# EAGLE board printer_v1 (EAGLE 9.6.2)
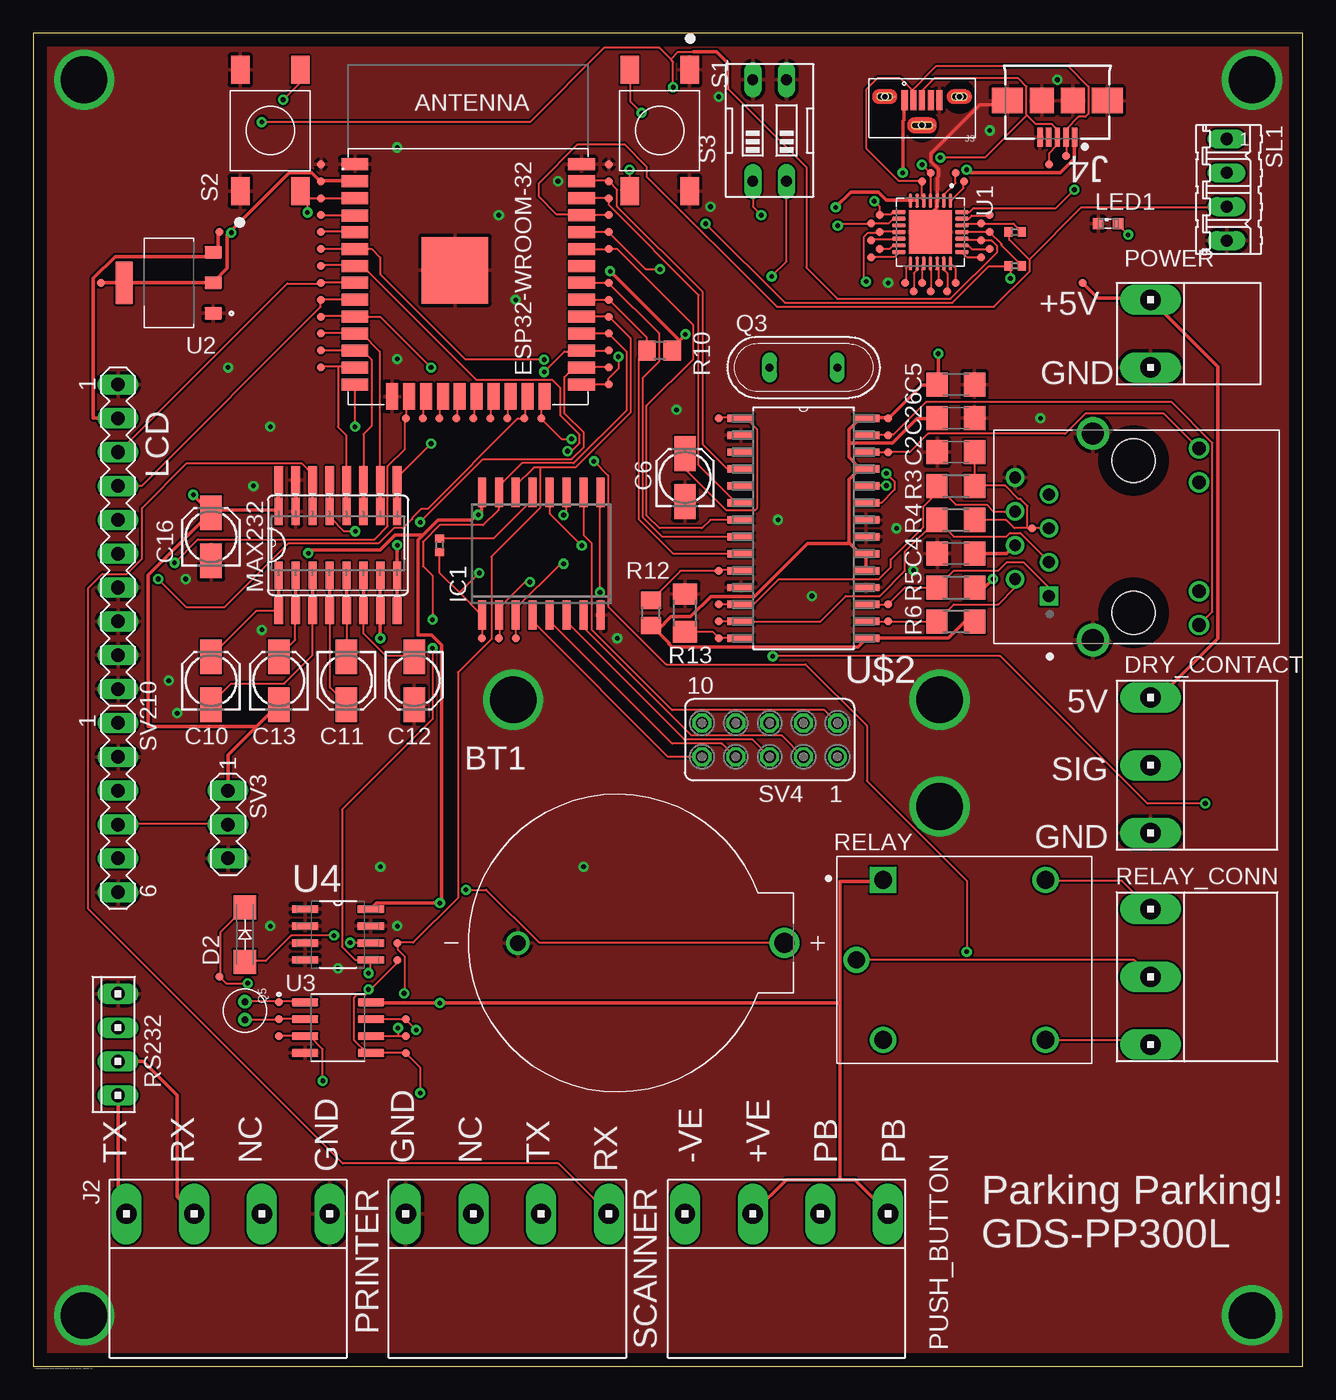
[diagram p2: board, top side]
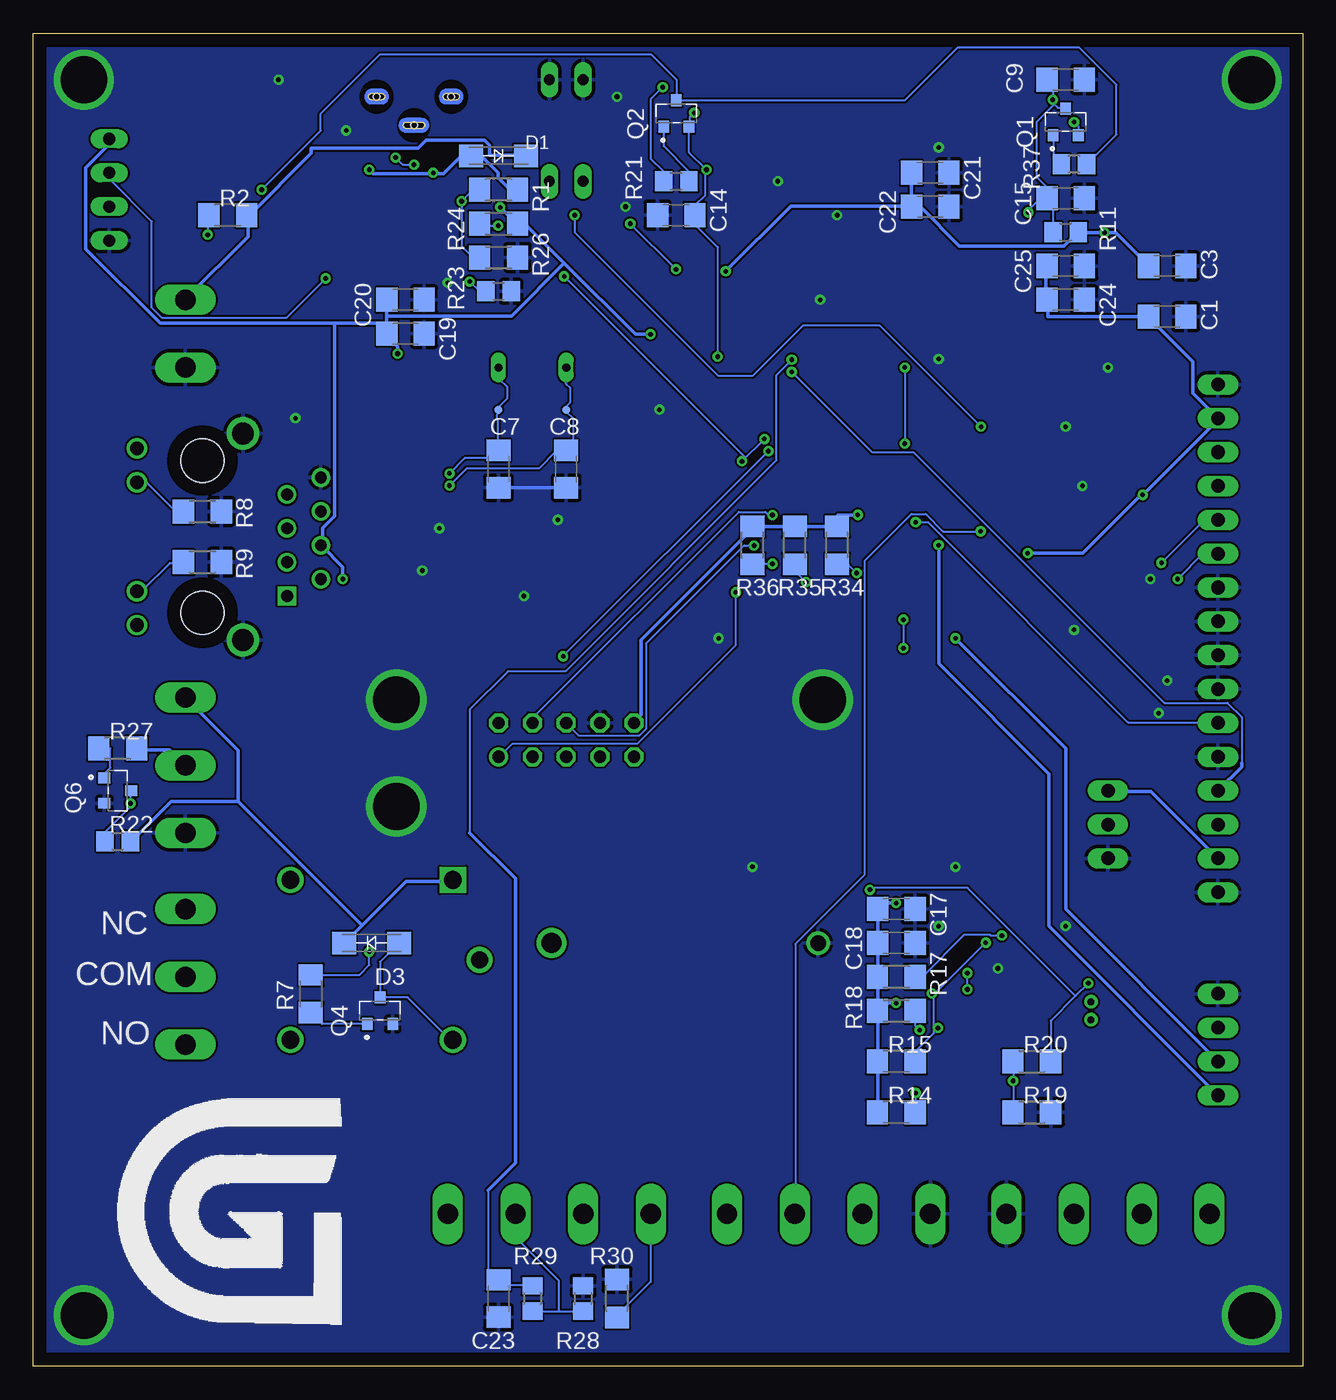
[diagram p3: board, bottom side, seen from below]

Size 95.23 x 100 mm. Coordinates in mm from the lower left corner, seen from the top.
Outline: 0,0 95.23,0 95.23,100 0,100 0,0
Copper layers (1*16): Top 0.035mm / dielectric 1.5mm / Bottom 0.035mm
Design rules "default": minimum track width 6mil, minimum drill 0.35mm, track to track 6mil, track to pad 6mil, pad to pad 6mil, via to via 6mil, smd to smd 6mil, copper to edge 40mil, drill to drill 6mil, minimum pad ring 10mil, minimum via ring 8mil, stop-mask expansion 4mil, vias tented up to drill 0mil, thermal gap 10mil
Net classes: 1 POWER: width 0.254 mm

## Footprints (pad centres in the part's own frame; a part is rotated, then mirrored left to right if it is on the bottom)
BAT_BS-7 = drill 1.5: + 10,0 | drill 1.17: - -10,0
C1206 = smd 1.6 x 1.8: 1 -1.4,0; 2 1.4,0
153CLV-0405 = smd 2.6 x 1.6: + 1.8,0; - -1.8,0
SMA-DO214AC = smd 1.8 x 1.7: A -2.05,0; K 2.05,0
10X05MTA_MYV = drill 1.524 long: 1 5.08,0; 3 0,0; 5 -5.08,0
SO16W = smd 0.6 x 2.2: 1 -4.445,-4.6; 2 -3.175,-4.6; 3 -1.905,-4.6; 4 -0.635,-4.6; 5 0.635,-4.6; 6 1.905,-4.6; 7 3.175,-4.6; 8 4.445,-4.6; 9 4.445,4.6; 10 3.175,4.6; 11 1.905,4.6; 12 0.635,4.6; 13 -0.635,4.6; 14 -1.905,4.6; 15 -3.175,4.6; 16 -4.445,4.6
HANRUN_HR911105A = drill 0.89 square: 1 4.45,-6.35 | drill 0.89: 2 3.18,-8.89; 3 1.91,-6.35; 4 0.64,-8.89; 5 -0.63,-6.35; 6 -1.9,-8.89; 7 -3.17,-6.35; 8 -4.44,-8.89 | drill 1.02: 9 6.625,4.9; 10 4.085,4.9; 11 -4.085,4.9; 12 -6.625,4.9 | drill 1.63: 15 7.745,-3.05; 16 -7.745,-3.05 | hole 3.25: -5.715,0; 5.715,0
10X07MTA_MYV = drill 1.524 long: 1 7.62,0; 3 2.54,0; 5 -2.54,0; 7 -7.62,0
MOLEX_105133-0001 = smd 0.45 x 1.5: 1 -1.3,-0.25; 2 -0.65,-0.25; 3 0,-0.25; 4 0.65,-0.25; 5 1.3,-0.25 | smd 0.1 x 0.1: S1 -2.05,0; S2 3.55,0; S3 0.95,-2.15 | hole 0.5: -2.8,0; 2.8,0; 0,-2.15
GCT_USB3065-XX-00-A_REVE = smd 0.4 x 1.4: 1 -1.3,0.5; 2 -0.65,0.5; 3 0,0.5; 4 0.65,0.5; 5 1.3,0.5 | smd 1.8 x 1.9: 6 1.15,-2.25; 7 -1.15,-2.25 | smd 2.3 x 1.9: 8 3.75,-2.25; 9 -3.75,-2.25
SML0603 = smd 0.8 x 0.8: A 0.75,0; C -0.75,0
SO16L = smd 0.66 x 2.032: 1 -4.445,-4.902; 2 -3.175,-4.902; 3 -1.905,-4.902; 4 -0.635,-4.902; 5 0.635,-4.902; 6 1.905,-4.902; 7 3.175,-4.902; 8 4.445,-4.902; 9 4.445,4.902; 10 3.175,4.902; 11 1.905,4.902; 12 0.635,4.902; 13 -0.635,4.902; 14 -1.905,4.902; 15 -3.175,4.902; 16 -4.445,4.902
10X03MTA_MYV = drill 1.524 long: 1 2.54,0; 3 -2.54,0
TRANS_MMSS8050-H-TP = smd 0.9 x 0.8: 1 -1,0.95; 2 -1,-0.95; 3 1,0
QS = drill 0.61 long: 1 -2.54,0; 2 2.54,0
XTAL_ECS-160-18-9X = drill 0.52 pad 0.92: 1 -0.677,0; 2 0.677,0
R1206 = smd 1.6 x 1.803: 1 -1.422,0; 2 1.422,0
R0805 = smd 1.3 x 1.5: 1 -0.95,0; 2 0.95,0
R0402 = smd 0.6 x 0.7: 1 -0.5,0; 2 0.5,0
RELAY_SRD-05VDC-SL-C = drill 1.32 square: A1 -6.1,6 | drill 1.32: A2 -6.1,-6; NC 6.1,6; NO 6.1,-6 | drill 1.29: COM -8.1,0
10X04MTA = drill 1.016 long: 1 3.81,0; 2 1.27,0; 3 -1.27,0; 4 -3.81,0
SW_5-1437565-0 = smd 2.1 x 1.4: 1 -4.55,2.25; 2 4.55,2.25; 3 -4.55,-2.25; 4 4.55,-2.25
EDG-02 = drill 0.813 long: 1 -1.27,-3.81; 2 1.27,-3.81; 3 1.27,3.81; 4 -1.27,3.81
04P = drill 0.914 long: 1 -3.81,0; 2 -1.27,0; 3 1.27,0; 4 3.81,0
MA10-1 = drill 1.016 long: 1 -11.43,0; 2 -8.89,0; 3 -6.35,0; 4 -3.81,0; 5 -1.27,0; 6 1.27,0; 7 3.81,0; 8 6.35,0; 9 8.89,0; 10 11.43,0
MA06-1 = drill 1.016 long: 1 -6.35,0; 2 -3.81,0; 3 -1.27,0; 4 1.27,0; 5 3.81,0; 6 6.35,0
MA03-1 = drill 1.016 long: 1 -2.54,0; 2 0,0; 3 2.54,0
FE05-2 = drill 0.914: 1 -5.08,1.27 | drill 0.914 octagon: 2 -5.08,-1.27; 3 -2.54,1.27; 4 -2.54,-1.27; 5 0,1.27; 6 0,-1.27; 7 2.54,1.27; 8 2.54,-1.27; 9 5.08,1.27; 10 5.08,-1.27
TP06R = smd 0.6 x 0.6: TP 0,0
QFN50P500X500X80-29N = smd 1.01 x 0.27: 1 -2.36,1.5; 2 -2.36,1; 3 -2.36,0.5; 4 -2.36,0; 5 -2.36,-0.5; 6 -2.36,-1; 7 -2.36,-1.5; 15 2.36,-1.5; 16 2.36,-1; 17 2.36,-0.5; 18 2.36,0; 19 2.36,0.5; 20 2.36,1; 21 2.36,1.5 | smd 0.27 x 1.01: 8 -1.5,-2.36; 9 -1,-2.36; 10 -0.5,-2.36; 11 0,-2.36; 12 0.5,-2.36; 13 1,-2.36; 14 1.5,-2.36; 22 1.5,2.36; 23 1,2.36; 24 0.5,2.36; 25 0,2.36; 26 -0.5,2.36; 27 -1,2.36; 28 -1.5,2.36 | smd 3.25 x 3.25: 29 0,0
SOT229P700X180-4N = smd 1.31 x 0.93: 1 -3.345,2.29; 2 -3.345,0; 3 -3.345,-2.29 | smd 1.31 x 3.24: 4 3.345,0
SOIC127P600X175-8N = smd 1.97 x 0.59: 1 -2.475,1.905; 2 -2.475,0.635; 3 -2.475,-0.635; 4 -2.475,-1.905; 5 2.475,-1.905; 6 2.475,-0.635; 7 2.475,0.635; 8 2.475,1.905
SOIC127P600X175-8N' = smd 1.981 x 0.559: 1 -2.464,1.905; 2 -2.464,0.635; 3 -2.464,-0.635; 4 -2.464,-1.905; 5 2.464,-1.905; 6 2.464,-0.635; 7 2.464,0.635; 8 2.464,1.905
SOIC127P600X175-16N = smd 2.057 x 0.61: 1 -4.801,8.89; 2 -4.801,7.62; 3 -4.801,6.35; 4 -4.801,5.08; 5 -4.801,3.81; 6 -4.801,2.54; 7 -4.801,1.27; 8 -4.801,0; 9 0,0; 10 0,1.27; 11 0,2.54; 12 0,3.81; 13 0,5.08; 14 0,6.35; 15 0,7.62; 16 0,8.89
SOIC127P1034X264-28N = smd 1.981 x 0.559: 1 -4.699,8.255; 2 -4.699,6.985; 3 -4.699,5.715; 4 -4.699,4.445; 5 -4.699,3.175; 6 -4.699,1.905; 7 -4.699,0.635; 8 -4.699,-0.635; 9 -4.699,-1.905; 10 -4.699,-3.175; 11 -4.699,-4.445; 12 -4.699,-5.715; 13 -4.699,-6.985; 14 -4.699,-8.255; 15 4.699,-8.255; 16 4.699,-6.985; 17 4.699,-5.715; 18 4.699,-4.445; 19 4.699,-3.175; 20 4.699,-1.905; 21 4.699,-0.635; 22 4.699,0.635; 23 4.699,1.905; 24 4.699,3.175; 25 4.699,4.445; 26 4.699,5.715; 27 4.699,6.985; 28 4.699,8.255
ESP32-WROOM-32 = smd 2 x 0.9: 1 0,0; 2 0,-1.27; 3 -0.01,-2.54; 4 0,-3.84; 5 0,-5.08; 6 0,-6.35; 7 0,-7.62; 8 0,-8.89; 9 0,-10.16; 10 0,-11.43; 11 0,-12.7; 12 0,-13.97; 13 0,-15.24; 14 0,-16.51; 25 16.999,-16.511; 26 16.999,-15.239; 27 17.001,-13.971; 28 16.999,-12.702; 29 16.997,-11.432; 30 16.999,-10.161; 31 17.002,-8.891; 32 17,-7.622; 33 17,-6.35; 34 17,-5.08; 35 17,-3.81; 36 17,-2.54; 37 17,-1.27; 38 17,0 | smd 0.9 x 2: 15 2.785,-17.41; 16 4.055,-17.41; 17 5.325,-17.41; 18 6.595,-17.41; 19 7.865,-17.41; 20 9.135,-17.41; 21 10.405,-17.41; 22 11.675,-17.41; 23 12.945,-17.41; 24 14.215,-17.41 | smd 5 x 5: 39 7.502,-7.946

## Placement (x,y rotation side)
BT1  BS-7  [BAT_BS-7]  46.35,31.75 0 top
C1  22uf  [C1206]  10.16,78.74 0 bottom
C2  0.1uf  [C1206]  69.22,68.58 0 top
C3  22uf  [C1206]  10.16,82.55 0 bottom
C4  0.1uf  [C1206]  69.22,60.96 0 top
C5  0.1uf  [C1206]  69.22,73.66 0 top
C6  10uf  [153CLV-0405]  48.9,66.67 90 top
C7  10pf  [C1206]  60.33,67.31 270 bottom
C8  10pf  [C1206]  55.24,67.31 270 bottom
C9  0.1uf  [C1206]  17.78,96.52 0 bottom
C10  1uf  [153CLV-0405]  13.34,51.44 90 top
C11  1uf  [153CLV-0405]  23.5,51.44 270 top
C12  1uf  [153CLV-0405]  28.57,51.44 270 top
C13  1uf  [153CLV-0405]  18.41,51.44 90 top
C14  0.1uf  [C1206]  46.99,86.36 180 bottom
C15  0.1uf  [C1206]  17.78,87.63 0 bottom
C16  1uf  [153CLV-0405]  13.34,62.23 90 top
C17  0.1uf  [C1206]  30.48,34.29 0 bottom
C18  0.1uf  [C1206]  30.48,31.75 0 bottom
C19  0.1uf  [C1206]  67.31,77.47 0 bottom
C20  4.7uf  [C1206]  67.31,80.01 0 bottom
C21  22uf  [C1206]  27.94,89.53 0 bottom
C22  0.1uf  [C1206]  27.94,87 0 bottom
C23  1uf  [C1206]  60.33,5.08 90 bottom
C24  0.1uf  [C1206]  17.78,80.01 0 bottom
C25  0.1uf  [C1206]  17.78,82.55 0 bottom
C26  0.1uf  [C1206]  69.22,71.12 0 top
D1  GF1  [SMA-DO214AC]  60.33,90.81 0 bottom
D2  GF1  [SMA-DO214AC]  15.88,32.38 90 top
D3  GF1  [SMA-DO214AC]  69.85,31.75 180 bottom
DRY_CONTACT  [10X05MTA_MYV]  83.82,45.09 270 top
IC1  PCF8574T  [SO16W]  38.1,60.96 0 top
J1  HR911105A  [HANRUN_HR911105A]  82.55,62.23 270 top
J2  [10X07MTA_MYV]  14.61,11.43 180 top
J3  105133-0001  [MOLEX_105133-0001]  66.67,95.25 0 top
J4  USB3065-XX-00-A_REVE  [GCT_USB3065-XX-00-A_REVE]  76.83,92.71 180 top
LED1  [SML0603]  80.64,85.72 0 top
MAX232  MAX232ECWE  [SO16L]  22.86,61.59 0 top
POWER  [10X03MTA_MYV]  83.82,77.47 270 top
PUSH_BUTTON  [10X07MTA_MYV]  56.52,11.43 180 top
Q1  MMSS8050-H-TP  [TRANS_MMSS8050-H-TP]  17.78,93.34 90 bottom
Q2  MMSS8050-H-TP  [TRANS_MMSS8050-H-TP]  46.99,93.98 90 bottom
Q3  [QS]  57.78,74.93 0 top
Q4  MMSS8050-H-TP  [TRANS_MMSS8050-H-TP]  69.22,26.67 90 bottom
Q5  ECS-327-18-9  [XTAL_ECS-160-18-9X]  15.88,26.67 270 top
Q6  MMSS8050-H-TP  [TRANS_MMSS8050-H-TP]  88.9,43.18 0 bottom
R1  22.1k  [R1206]  60.33,88.27 0 bottom
R2  2k  [R1206]  80.64,86.36 0 bottom
R3  50  [R1206]  69.22,66.04 180 top
R4  50  [R1206]  69.22,63.5 180 top
R5  50  [R1206]  69.22,58.42 180 top
R6  50  [R1206]  69.22,55.88 180 top
R7  330  [R1206]  74.42,27.94 90 bottom
R8  220  [R1206]  82.55,64.14 180 bottom
R9  220  [R1206]  82.55,60.33 180 bottom
R10  10k  [R0805]  46.99,76.2 180 top
R11  10k  [R0805]  17.78,85.09 0 bottom
R12  10k  [R0805]  46.35,56.52 90 top
R13  2k  [R1206]  48.9,56.52 270 top
R14  3.3K  [R1206]  30.48,19.05 0 bottom
R15  3.3K  [R1206]  30.48,22.86 0 bottom
R17  200  [R1206]  30.48,29.21 0 bottom
R18  3.3K  [R1206]  30.48,26.67 180 bottom
R19  1.5M  [R1206]  20.32,19.05 180 bottom
R20  510K  [R1206]  20.32,22.86 180 bottom
R21  10k  [R0805]  46.99,88.9 0 bottom
R22  10k  [R0805]  88.9,39.37 0 bottom
R23  10k  [R0805]  60.33,80.64 0 bottom
R24  2k  [R1206]  60.33,85.72 180 bottom
R26  47.5k  [R1206]  60.33,83.19 180 bottom
R27  330  [R1206]  88.9,46.35 0 bottom
R28  10k  [R0805]  53.98,5.08 270 bottom
R29  10k  [R0805]  57.78,5.08 270 bottom
R30  330  [R1206]  51.44,5.08 270 bottom
R34  3.3K  [R1206]  34.92,61.59 270 bottom
R35  3.3K  [R1206]  38.1,61.59 270 bottom
R36  3.3K  [R1206]  41.27,61.59 270 bottom
R37  10k  [R0805]  17.14,90.17 180 bottom
R38  50  [R0402]  73.66,85.09 0 top
R39  50  [R0402]  73.66,82.55 0 top
R40NC  50  [R0402]  30.48,61.59 90 top
RELAY  SRD-05VDC-SL-C  [RELAY_SRD-05VDC-SL-C]  69.85,30.48 0 top
RELAY_CONN  [10X05MTA_MYV]  83.82,29.21 270 top
RS232  [10X04MTA]  6.35,24.13 90 top
S1  5-1437565-0  [SW_5-1437565-0]  46.99,92.71 270 top
S2  5-1437565-0  [SW_5-1437565-0]  17.78,92.71 90 top
S3  [EDG-02]  55.24,92.71 0 top
SCANNER  [10X07MTA_MYV]  35.56,11.43 180 top
SL1  [04P]  89.53,88.27 270 top
SV1  [MA10-1]  6.35,62.23 270 top
SV2  [MA06-1]  6.35,41.91 270 top
SV3  [MA03-1]  14.61,40.64 270 top
SV4  [FE05-2]  55.24,46.99 180 top
TP1  TPTP06R  [TP06R]  21.59,87.63 0 top
TP2  TPTP06R  [TP06R]  21.59,86.36 0 top
TP3  TPTP06R  [TP06R]  21.59,85.09 0 top
TP4  TPTP06R  [TP06R]  21.59,83.82 0 top
TP5  TPTP06R  [TP06R]  21.59,82.55 0 top
TP6  TPTP06R  [TP06R]  21.59,81.28 0 top
TP7  TPTP06R  [TP06R]  21.59,80.01 0 top
TP8  TPTP06R  [TP06R]  21.59,78.74 0 top
TP9  TPTP06R  [TP06R]  21.59,77.47 0 top
TP10  TPTP06R  [TP06R]  21.59,76.2 0 top
TP11  TPTP06R  [TP06R]  21.59,74.93 0 top
TP13  TPTP06R  [TP06R]  21.59,90.17 0 top
TP14  TPTP06R  [TP06R]  27.94,71.12 0 top
TP15  TPTP06R  [TP06R]  29.21,71.12 0 top
TP16  TPTP06R  [TP06R]  30.48,71.12 0 top
TP17  TPTP06R  [TP06R]  31.75,71.12 0 top
TP18  TPTP06R  [TP06R]  33.02,71.12 0 top
TP19  TPTP06R  [TP06R]  34.29,71.12 0 top
TP20  TPTP06R  [TP06R]  35.56,71.12 0 top
TP21  TPTP06R  [TP06R]  36.83,71.12 0 top
TP22  TPTP06R  [TP06R]  38.1,71.12 0 top
TP23  TPTP06R  [TP06R]  43.18,88.9 0 top
TP24  TPTP06R  [TP06R]  43.18,87.63 0 top
TP25  TPTP06R  [TP06R]  43.18,86.36 0 top
TP26  TPTP06R  [TP06R]  43.18,85.09 0 top
TP27  TPTP06R  [TP06R]  43.18,83.82 0 top
TP28  TPTP06R  [TP06R]  43.18,81.28 0 top
TP29  TPTP06R  [TP06R]  43.18,80.01 0 top
TP30  TPTP06R  [TP06R]  27.94,24.77 0 top
TP31  TPTP06R  [TP06R]  27.94,23.5 0 top
TP32  TPTP06R  [TP06R]  43.18,76.2 0 top
TP33  TPTP06R  [TP06R]  43.18,74.93 0 top
TP34  TPTP06R  [TP06R]  43.18,73.66 0 top
TP50  TPTP06R  [TP06R]  51.44,71.12 0 top
TP53  TPTP06R  [TP06R]  51.44,54.61 0 top
TP54  TPTP06R  [TP06R]  60.33,71.75 0 bottom
TP55  TPTP06R  [TP06R]  51.44,59.69 0 top
TP56  TPTP06R  [TP06R]  51.44,57.15 0 top
TP57  TPTP06R  [TP06R]  51.44,55.88 0 top
TP58  TPTP06R  [TP06R]  43.18,90.17 0 top
TP59  TPTP06R  [TP06R]  21.59,88.9 0 top
TP62  TPTP06R  [TP06R]  64.14,55.88 0 top
TP63  TPTP06R  [TP06R]  64.14,57.15 0 top
TP64  TPTP06R  [TP06R]  55.24,71.75 0 bottom
TP65  TPTP06R  [TP06R]  64.14,68.58 0 top
TP66  TPTP06R  [TP06R]  64.14,69.85 0 top
TP68  TPTP06R  [TP06R]  74.93,62.87 0 top
TP71  TPTP06R  [TP06R]  5.08,81.28 0 top
TP78  TPTP06R  [TP06R]  13.97,29.21 0 top
TP79  TPTP06R  [TP06R]  27.3,31.75 0 top
TP80  TPTP06R  [TP06R]  18.41,27.3 0 top
TP81  TPTP06R  [TP06R]  27.3,30.48 0 top
TP82  TPTP06R  [TP06R]  18.41,24.77 0 top
TP83  TPTP06R  [TP06R]  13.97,85.09 90 top
TP84  TPTP06R  [TP06R]  27.94,26.04 0 top
TP85  TPTP06R  [TP06R]  18.41,26.04 0 top
TP86  TPTP06R  [TP06R]  43.18,78.74 0 top
TP87  TPTP06R  [TP06R]  78.74,81.28 0 top
TP88  TPTP06R  [TP06R]  43.18,77.47 0 top
TP89  TPTP06R  [TP06R]  33.66,54.61 0 top
TP90  TPTP06R  [TP06R]  34.92,54.61 0 top
TP91  TPTP06R  [TP06R]  36.2,54.61 0 top
TP99  TPTP06R  [TP06R]  66.67,88.9 0 top
TP100  TPTP06R  [TP06R]  67.31,89.53 0 top
TP102  TPTP06R  [TP06R]  64.14,71.12 0 top
TP103  TPTP06R  [TP06R]  71.75,85.09 0 top
TP104  TPTP06R  [TP06R]  71.12,85.72 0 top
TP105  TPTP06R  [TP06R]  71.12,84.45 0 top
TP106  TPTP06R  [TP06R]  71.75,83.82 0 top
TP107  TPTP06R  [TP06R]  71.75,86.36 0 top
TP109  TPTP06R  [TP06R]  69.85,88.9 0 top
TP110  TPTP06R  [TP06R]  76.2,90.17 0 top
TP111  TPTP06R  [TP06R]  77.47,90.81 0 top
TP112  TPTP06R  [TP06R]  62.87,85.72 0 top
TP113  TPTP06R  [TP06R]  69.22,89.53 0 top
TP114  TPTP06R  [TP06R]  63.5,86.36 0 top
TP115  TPTP06R  [TP06R]  67.94,81.28 0 top
TP116  TPTP06R  [TP06R]  67.31,80.64 0 top
TP117  TPTP06R  [TP06R]  66.67,81.28 0 top
TP118  TPTP06R  [TP06R]  66.04,80.64 0 top
TP119  TPTP06R  [TP06R]  71.12,83.19 0 top
TP120  TPTP06R  [TP06R]  69.22,81.28 0 top
TP121  TPTP06R  [TP06R]  68.58,80.64 0 top
TP122  TPTP06R  [TP06R]  62.87,84.45 0 top
TP123  TPTP06R  [TP06R]  63.5,85.09 0 top
TP124  TPTP06R  [TP06R]  62.87,83.19 0 top
TP125  TPTP06R  [TP06R]  65.41,81.28 0 top
TP126  TPTP06R  [TP06R]  63.5,83.82 0 top
U1  CP2102N-A01-GQFN28  [QFN50P500X500X80-29N]  67.31,85.09 270 top
U2  AMS1117  [SOT229P700X180-4N]  10.16,81.28 180 top
U3  DS1307Z+  [SOIC127P600X175-8N]  22.86,25.4 0 top
U4  CAT24C32WI-GT3  [SOIC127P600X175-8N']  22.86,32.38 0 top
U5  MAX232D  [SOIC127P600X175-16N]  27.3,64.14 90 top
U$2  ENC28J60/SO  [SOIC127P1034X264-28N]  57.78,62.87 0 top
U$3  ESP32-WROOM-32  [ESP32-WROOM-32]  24.13,90.17 0 top

## Tracks (layer width: path | path; a pad name or v marks a point on that pad's centre or on a via)
3V3  (via drill 0.35)
  Top 0.254: U$2.19 U$2.20 62.41,61.04 61.95,61.04 61.19,61.8 | 61.27,69.34 61.19,69.42 61.19,70.26 61.95,71.02 62.41,71.02 U$2.28 62.48,71.17 64.08,71.17 TP102.TP 64.24,71.17 66.67,73.61 67.74,73.61 C5.1 67.89,73.76 v67.89,75.97 | 61.27,69.34 61.34,69.27 64.47,69.27 66.29,71.09 67.74,71.09 C26.1 | 61.27,69.34 61.19,69.27 61.19,68.2 62.03,67.36 62.48,67.36 U$2.25 61.95,67.28 61.19,66.52 61.19,61.8 | R6.1 70.56,55.85 69.88,55.85 68.66,54.63 62.56,54.63 U$2.15 62.48,54.56 61.87,53.95 47.93,53.95 47.7,54.18 47.7,54.25 46.41,55.55 R12.1 46.86,55.24 47.85,56.24 49.3,56.24 50.83,57.76 54.1,57.76 58.06,61.72 61.11,61.72 61.19,61.8 | U$3.2 24.08,88.92 21.64,88.92 TP59.TP 21.49,88.92 20.88,89.53 19.2,89.53 14.78,85.11 | TP71.TP 5.11,81.31 6.78,81.31 U2.4 6.93,81.31 13.49,81.31 U2.2 13.56,81.38 14.55,82.37 14.55,84.89 14.78,85.11 | v14.86,85.04 14.78,85.11 | C4.2 73,60.96 73.61,61.57 J1.4 | v72.01,59.05 71.4,58.45 70.64,58.45 R5.1 | U1.6 66.29,87.48 65.84,87.48 U1.7 65.68,87.48 64.01,87.48 63.4,88.09 61.34,88.09 v60.2,86.94 | v48.92,77.42 48.46,76.96 | 48.46,76.96 48.01,76.5 48.01,76.2 R10.1 | 48.46,76.96 v43.28,82.14
  Bottom 0.254: C22.1 29.34,87.02 C21.1 | C3.1 11.58,82.6 14.02,85.04 v14.86,85.04 16.76,85.04 R11.2 16.92,85.04 17.91,84.05 25.76,84.05 28.65,86.94 29.26,86.94 C22.1 | v72.01,59.05 72.01,59.97 73.61,61.57 J1.4 73.53,61.65 73.53,62.87 72.62,63.78 72.62,78.26 | 68.73,78.79 68.73,80.01 C20.1 | 68.73,78.79 68.73,77.5 C19.1 | v60.2,86.94 58.98,85.72 R24.1 58.83,85.65 58.29,85.65 55.4,82.75 | v48.92,77.42 50.06,77.42 55.4,82.75 | 68.73,78.79 59.36,78.79 55.4,82.75 | SL1.1 89.53,91.67 91.29,89.92 91.29,83.82 85.72,78.26 72.62,78.26 | 72.62,78.26 68.81,78.26 C19.1 | v43.28,82.14 38.41,87.02 29.41,87.02 C22.1 | v67.89,75.97 67.89,76.5 68.73,77.34 C19.1
BAT  (via drill 0.35)
  Top 0.152: TP82.TP U3.3 20.73,24.77 21.72,23.77 v21.72,21.41
  Bottom 0.152: R19.2 21.72,19.05 v21.72,21.41 21.72,22.86 R20.2
CS_IO18
  Top 0.152: U$3.30 41.15,80.01 TP29.TP 43.2,80.01 46.02,77.19 46.02,76.2 | U$2.9 48.01,60.96 45.41,63.55 45.41,75.59 46.02,76.2 | 46.02,76.2 R10.2
CTS
  Top 0.152: TP106.TP 70.41,83.82 70.18,84.05 69.72,84.05 U1.23
DCD
  Top 0.152: TP109.TP 69.8,88.85 69.8,88.39 68.89,87.48 U1.1
DSR
  Top 0.152: TP107.TP 71.7,86.33 70.41,86.33 70.18,86.11 69.72,86.11 U1.27
DTR  (via drill 0.35)
  Top 0.152: U1.28 70.23,86.59 70.53,86.89 76.73,86.89 v78.11,88.27
  Bottom 0.152: v78.11,88.27 73.66,92.71 73.66,93.98 69.22,98.42 48.9,98.42 46.99,96.52 Q2.3 29.84,94.98 25.92,98.91 16.75,98.91 13.97,96.13 13.97,92.39 R37.1
EN  (via drill 0.35)
  Top 0.152: 20.57,87.63 20.5,87.63 20.04,88.09 S2.3 20.57,87.63 | 20.57,87.63 TP1.TP U$3.3 | v18.75,95.02 19.96,96.24 19.96,97.23 S2.4 | v20.57,86.56 20.57,87.63
  Bottom 0.152: R11.1 18.75,85.11 18.75,87.25 19.13,87.63 C15.1 19.2,87.63 | 18.63,94.68 18.75,94.79 v18.75,95.02 18.75,96.09 19.13,96.47 C9.1 | 18.63,94.68 18.36,94.41 17.83,94.41 Q1.3 | 19.2,87.63 19.2,88.47 19.96,89.23 19.96,93.34 18.63,94.68 | v20.57,86.56 20.57,86.72 19.66,87.63 19.2,87.63
EXT_5V  (via drill 0.35)
  Top 0.254: TP83.TP 13.88,85 13.88,83.62 13.62,83.62 U2.3 13.5,83.5 13.25,83.25 6.12,83.25 4.5,81.62 4.5,71.12 6.25,71.12 SV1.2 | MAX232.16 18.38,66.38 18.38,64.25 U5.16 18.25,64.25 13.5,64.25 13.38,64.12 C16.+ | 16.69,47.94 14.62,45.88 14.62,43.25 SV3.1 | 16.69,47.94 18.38,49.62 C13.- | C16.+ 13.25,64 8.62,59.38 8.62,48 16.62,48 16.69,47.94 | v12,65.38 13.25,64.12 C16.+ | TP87.TP 78.75,81.25 79.88,80.12 83.75,80.12 POWER.3 83.88,80 88.88,75 88.88,54.61 84.52,50.25 83.88,50.25 DRY_CONTACT.5 | IC1.16 33.62,65.5 33.62,63.88 v33.38,63.88 33.25,63.88 32.88,63.5 30.38,63.5 29.19,62.31 | U4.8 25.38,34.38 25.75,34.75 v30.5,34.75 30.5,34.88 30.62,34.88 30.62,54.12 29.88,54.88 28.88,54.88 28.88,62 29.19,62.31 | U3.8 25.38,27.25 v30.5,27.25 60.5,27.25 | 60.5,14 61.62,14 64.12,11.5 PUSH_BUTTON.7 | 60.5,14 56.5,14 54,11.5 PUSH_BUTTON.3 | 60.5,27.25 60.5,36.38 63.75,36.38 RELAY.A1 | 60.5,27.25 60.5,14 | v20.62,61 20.88,61.25 26,61.25 27.12,62.38 29.12,62.38 29.19,62.31
  Bottom 0.254: C25.1 19.25,82.5 19.25,80.12 C24.1 19.12,80 19.12,78.75 11.62,78.75 C1.1 11.5,78.62 8.25,75.38 8.25,73 6.38,71.12 SV1.2 6.38,71 v12,65.38 12.12,65.38 16.5,61 v20.62,61 | SV2.5 11.38,43.12 14.5,43.12 SV3.1 | D1.K 58.38,90.88 61,90.88 61,91.62 61.38,92 65.75,92 66.38,91.38 74.38,91.38 74.38,91 79.12,86.25 R2.2 79.12,86.12 79.12,84.75 83.75,80.12 POWER.3 | v33.38,63.88 34.88,63.88 34.88,63.12 R34.1 35,63 38,63 R35.1 38.12,63 41.25,63 R36.1 41.25,62.88 49.62,54.5 49.62,48.88 50.12,48.38 SV4.10 | v30.5,34.75 31.88,34.75 31.88,34.38 C17.1 31.88,34.25 C18.1 31.88,31.62 31.88,29.25 R17.1 31.88,29.12 31.88,26.75 R18.2 | R14.1 31.88,19.12 31.88,22.75 R15.1 31.88,22.88 31.88,26.62 R18.2 | v30.5,27.25 31.75,27.25 R18.2 | 70.56,33.06 67.25,36.38 63.75,36.38 RELAY.A1 | 70.56,33.06 71.88,31.75 D3.K | R22.2 87.88,39.38 84.9,42.35 79.85,42.35 | 70.56,33.06 79.85,42.35 | DRY_CONTACT.5 79.85,46.2 79.85,42.35
GND  (via drill 0.35, 3.5)
  Top 0.254: U1.29 67.36,85.11 67.36,86.49 67.74,86.87 67.74,87.4 U1.3 67.82,87.55 67.82,89.15 67.89,89.23 67.89,89.84 67.36,90.37 67.36,90.98 71.02,94.64 72.77,94.64 73,94.87 | U5.15 MAX232.15
  Bottom 0.254: C8.2 C7.2
  other vias: 55.88,63.5 43.81,54.61 48.26,71.75 50.8,87 39.37,88.9 64.77,62.87 58.42,57.78 66.04,59.69 22.86,29.84 17.78,33.02 27.3,33.02 41.27,37.47 51.44,95.25 27.3,91.44 27.3,75.56 16.51,66.04 75.56,71.12 76.83,96.52 71.75,92.71 26.04,37.47 36.2,80.01 34.92,86.36 14.61,74.93 17.78,70.48 3.81,96.52 3.81,3.81 91.44,3.81 91.44,96.52 36,50 68,50 68,42 64.14,81.28 11.43,59.05 17.14,55.24 10.79,49 10.16,51.44
  pour Top: 0,100.33 95.25,100.33 95.25,0 0,0
  pour Bottom: 0,100.33 95.25,100.33 95.25,0 0,0
INT_IO23
  Top 0.152: U$2.4 52.07,67.31 50.23,69.15 50.23,80.58 43.81,87 43.81,88.27 TP23.TP 43.13,88.92 41.15,88.92 U$3.37
IO0  (via drill 0.35)
  Top 0.152: U$3.25 41.15,73.69 43.13,73.69 TP34.TP 43.13,73.76 43.13,74.07 43.89,74.83 v43.89,75.74 | v44.73,89.76 44.73,88.16 S1.4 | v45.64,94.03 44.81,94.87 44.81,97.23 S1.3
  Bottom 0.152: 44.81,89.76 44.81,87.86 45.57,87.1 45.57,86.41 C14.1 45.57,86.33 45.57,85.65 43.89,83.97 v43.89,75.74 | 44.81,89.76 44.81,89.84 46.02,91.06 46.02,92.96 Q2.2 45.95,92.96 45.95,93.73 v45.64,94.03 | 44.81,89.76 v44.73,89.76
IO2  (via drill 0.35)
  Top 0.152: U$3.24 38.33,72.69 38.1,72.47 TP22.TP 38.1,71.09 39.62,69.57 v40.39,69.57 | v42.06,67.89 43.13,66.83 43.13,57 47.47,52.65 57.94,52.65 62.53,48.06 62.53,43.92 70.03,36.42 v70.03,31.09 | S3.2 56.52,82.88 v55.4,81.76
  Bottom 0.152: v40.39,69.57 v42.06,67.89 41.83,68.2 v55.4,81.76 | R7.2 70.77,29.36 70.03,30.1 v70.03,31.09
IO4  (via drill 0.35)
  Top 0.152: TP33.TP 43.13,74.98 41.15,74.98 U$3.26 41.07,74.91 40.54,74.91 39.85,74.22 39.85,71.48 41.3,70.03 41.3,68.96 40.39,68.05 33.76,68.05 v29.03,63.32
  Bottom 0.152: v29.03,63.32 28.12,63.32 13.11,48.31 6.4,48.31 SV2.1
IO12  (via drill 0.35)
  Top 0.152: S3.1 53.98,87 v54.61,86.36 | v24.13,70.48 U$3.14
  Bottom 0.152: v54.61,86.36 54.61,85.09 43.81,74.3 41.27,74.3 37.47,78.11 31.75,78.11 v24.13,70.48
IO13  (via drill 0.35)
  Top 0.152: U$3.16 28.12,72.69 27.96,72.54 27.96,71.17 TP14.TP 27.89,71.09 27.89,68.81 26.59,67.51 26.59,63.02 25.6,62.03 12.34,62.03 v10.59,60.27
  Bottom 0.152: v10.59,60.27 7.39,63.48 6.4,63.48 SV1.5
IO15  (via drill 0.35)
  Top 0.152: U$3.23 37.03,72.69 36.88,72.54 36.88,71.17 TP21.TP 36.8,71.09 36.35,71.09 29.57,64.31 29.11,64.31 28.42,63.63 28.42,63.55 27.74,62.87 27.05,62.87 25.91,61.72 19.13,61.72 14.33,56.92 11.51,56.92 v9.37,59.05
  Bottom 0.152: v9.37,59.05 7.47,60.96 SV1.6
IO16  (via drill 0.35)
  Top 0.152: TP32.TP 41.15,76.2 U$3.27 41.07,76.12 39.85,76.12 v38.33,74.6
  Bottom 0.152: 4.57,45.26 4.57,48.69 5.64,49.76 10.36,49.76 29.18,68.58 32.31,68.58 v38.33,74.6
  Bottom 0.254: 4.57,45.26 4.57,44.96 SV2.3
IO32
  Top 0.152: U$3.8 24.08,81.31 21.64,81.31 TP6.TP 21.57,81.23 19.05,81.23 6.4,68.58 SV1.3
IO33
  Top 0.152: U$3.9 TP7.TP 21.57,80.01 21.57,79.48 8.15,66.06 6.4,66.06 SV1.4
IO34  (via drill 0.35)
  Top 0.152: TP4.TP U$3.6 25.4,83.82 26.04,83.19 26.04,81.92 32.38,75.56 38.33,75.56 v38.33,75.51
  Bottom 0.152: R29.1 57.84,6.1 59.89,6.1 60.27,6.48 C23.2 61.11,7.27 61.11,13.18 | v38.33,75.51 39.47,74.37 39.47,67.97 55.31,52.13 59.63,52.13 62.48,49.28 62.48,40.01
  Bottom 0.254: 62.48,40.01 59.05,36.58 59.05,15.24 61.11,13.18
IO35  (via drill 0.35)
  Top 0.152: TP5.TP 21.64,82.6 24.08,82.6 U$3.7 24.16,82.53 24.71,82.53 33.25,73.99 38.94,73.99 39.55,73.38 39.55,71.32 41,69.88 41,69.27 40.39,68.66 v40.08,68.66 | v55.47,53.26 72.54,53.26 83.59,42.22 v87.94,42.22
  Bottom 0.152: Q6.3 87.94,43.13 v87.94,42.22 87.94,41.99 89.84,40.08 89.84,39.4 R22.1 | v55.47,53.26 v40.08,68.66
LEDA
  Top 0.152: U$2.27 62.48,69.88 64.08,69.88 TP66.TP 64.16,69.88 64.54,69.88 66.98,72.31 85.42,72.31 88.47,69.27 88.47,56.62 87.48,55.63 J1.9
LEDB
  Top 0.152: U$2.26 TP65.TP 65.76,68.58 67.13,69.95 77.42,69.95 78.94,71.48 84.81,71.48 87.4,68.89 J1.12
N$1  (via drill 0.35)
  Top 0.152: v82.14,84.89 81.46,85.57 81.46,85.72 LED1.A
  Bottom 0.152: v82.14,84.89 82.14,86.26 82.07,86.33 R2.1
N$2
  Bottom 0.152: Q1.1 18.67,92.28 18.67,90.75 18.14,90.22 R37.2
N$3
  Bottom 0.152: Q2.1 47.93,92.96 47.93,91.52 46.02,89.61 46.02,88.92 R21.2
N$4  (via drill 0.35)
  Top 0.152: U1.8 64.92,86.56 64.47,86.56 64.31,86.41 63.55,86.41 TP114.TP 63.48,86.41 63.48,87.02 v63.09,87.4
  Bottom 0.152: R1.1 61.8,88.24 62.26,88.24 v63.09,87.4 63.09,84.05 62.26,83.21 61.8,83.21 R26.2
N$5
  Top 0.152: SV2.4 6.4,40.69 14.55,40.69 SV3.2
N$6  (via drill 0.35)
  Top 0.152: U1.11 64.92,85.11 63.55,85.11 TP123.TP 63.48,85.04 62.64,85.04 62.33,84.73 62.33,81.53 v62.48,81.38
  Bottom 0.152: v62.48,81.38 61.8,80.7 61.34,80.7 R23.1
N$7
  Bottom 0.152: R8.2 83.97,64.16 84.58,64.16 86.72,66.29 87.4,66.29 J1.11
N$8
  Top 0.152: C2.2 70.64,68.58 70.64,66.06 R3.1 70.71,66.06 72.92,66.06 73.91,65.08 74.07,65.08 74.6,64.54 74.6,62.87 | J1.5 TP68.TP 74.6,62.87 | 74.6,62.87 73.61,62.87 73,63.48 70.64,63.48 R4.1
N$9
  Bottom 0.152: R9.2 83.97,60.27 84.96,60.27 87.02,58.22 87.4,58.22 J1.10
N$10
  Top 0.152: TP115.TP 67.89,81.31 67.89,82.6 67.82,82.68 U1.19
N$11
  Top 0.152: TP116.TP 67.36,80.7 67.36,82.68 U1.18
N$12
  Top 0.152: MAX232.1 16.76,56.69 13.34,53.26 C10.+
  Top 0.254: MAX232.1 U5.1
N$13
  Top 0.152: TP117.TP 66.67,82.6 66.75,82.68 U1.17
N$14
  Top 0.152: MAX232.3 20.95,53.34 18.82,51.21 14.86,51.21 13.34,49.68 C10.-
  Top 0.254: MAX232.3 U5.3
N$15
  Top 0.152: MAX232.5 23.55,56.69 23.55,56.52 23.55,53.26 C11.-
  Top 0.254: U5.5 23.5,56.57 23.55,56.52
N$16  (via drill 0.35)
  Top 0.152: U1.9 64.92,86.03 64.47,86.03 64.16,85.72 TP112.TP 60.5,85.72 v60.35,85.57
  Bottom 0.152: v60.35,85.57 61.57,85.57 61.72,85.72 R24.2
N$17
  Top 0.152: TP118.TP 66.06,80.7 66.06,81.99 66.29,82.22 66.29,82.68 U1.16
N$18
  Top 0.152: MAX232.4 22.25,56.69 22.25,56.52 22.25,50.9 23.47,49.68 C11.+
  Top 0.254: U5.4 22.23,56.54 22.25,56.52
N$19
  Top 0.152: MAX232.6 24.77,54.97 26.47,53.26 28.57,53.26 C12.-
  Top 0.254: U5.6 MAX232.6
N$20
  Top 0.152: MAX232.2 19.66,56.69 19.66,54.48 18.44,53.26 C13.+ | U5.2 19.74,59.36 19.68,59.36
  Top 0.254: MAX232.2 U5.2 19.68,59.36
N$21
  Top 0.152: RELAY_CONN.5 81.69,36.42 75.97,36.42 RELAY.NC
N$22
  Top 0.152: RELAY.COM 82.6,30.48 83.82,29.26 RELAY_CONN.3
N$23  (via drill 0.35)
  Top 0.152: v42.52,58.06 42.52,65.53 IC1.9
  Bottom 0.152: v42.52,58.06 42.52,54.1 49.91,46.71 59.28,46.71 60.27,45.72 SV4.1
N$24
  Top 0.152: R40NC.2 30.48,62.1 34.52,62.1 37.41,65 37.41,65.53 IC1.13
N$25
  Top 0.152: TP119.TP 71.09,83.21 70.03,83.21 69.72,83.52 U1.22
N$26
  Top 0.152: RELAY.NO 75.97,24.46 83.52,24.46 83.82,24.16 RELAY_CONN.1
N$27
  Bottom 0.152: RELAY.A2 63.78,24.54 64.01,24.54 67.14,27.67 Q4.3 69.22,30.34 D3.A
N$28  (via drill 0.35)
  Top 0.152: v22.55,32.31 19.36,32.31 17.45,30.4 15.93,30.4 D2.A
  Bottom 0.152: v22.55,32.31 23.39,32.31 23.47,32.38 25.38,32.38 28.5,29.26 29.03,29.26 R17.2
N$29  (via drill 0.35)
  Top 0.152: D2.K 15.85,34.37 14.02,32.54 14.02,29.26 TP78.TP 14.02,29.18 14.48,28.73 v16.08,28.73 | v32.46,35.74 33.98,35.74 37.95,31.77 56.31,31.77 BT1.+
  Bottom 0.152: R20.1 18.9,25.91 17.03,27.77 | v16.08,28.73 17.03,27.77 | R20.1 | v32.46,35.74 32.31,35.89 25.15,35.89 17.03,27.77
N$30
  Top 0.152: TP120.TP 69.19,81.31 69.19,82.37 68.89,82.68 U1.21
N$31
  Top 0.152: TP121.TP 68.58,81.99 68.35,82.22 68.35,82.68 U1.20
N$32
  Bottom 0.152: R27.1 89.46,46.35 89.46,44.88 89.84,44.5 89.84,44.2 Q6.1
N$33
  Bottom 0.152: 55.83,4.12 57.76,4.12 R29.2 | 55.83,4.12 54.03,4.12 R28.2 | 55.83,4.12 55.83,6.45 59.05,9.68 PUSH_BUTTON.5
N$34
  Top 0.152: TP122.TP 62.87,84.51 64.85,84.51 64.92,84.58 U1.12
N$35
  Bottom 0.152: 87,46.25 87.38,46.25 R27.2
  Bottom 0.254: DRY_CONTACT.3 84.98,46.25 87,46.25
N$36
  Top 0.152: IC1.7 41.3,56.31 41.3,55.4 49.38,47.32 56.16,47.32 57.76,45.72 SV4.3
N$37
  Top 0.152: IC1.6 40.01,55.85 48.84,47.02 53.95,47.02 SV4.5
N$38
  Top 0.152: IC1.5 38.79,56.31 38.79,55.85 47.93,46.71 51.66,46.71 52.65,45.72 SV4.7
N$39
  Top 0.152: TP124.TP 62.87,83.21 64.62,83.21 64.92,83.52 U1.14
N$40
  Bottom 0.152: R30.2 51.44,3.81 48.92,6.33 48.92,11.43 PUSH_BUTTON.1
N$41
  Top 0.152: TP125.TP 65.46,81.31 65.46,82.37 65.76,82.68 U1.15
N$42
  Top 0.152: TP126.TP 64.24,83.82 64.47,84.05 64.92,84.05 U1.13
N$43
  Top 0.152: SV4.9 47.62,45.72 37.49,55.85 37.49,56.31 IC1.4
N$44
  Top 0.152: SV4.2 59.36,49.23 47.93,49.23 41.91,55.24 41.91,61.72 41.3,62.33 41.3,65.53 IC1.10
N$45  (via drill 0.35)
  Top 0.152: TP89.TP 33.68,54.63 33.68,56.31 IC1.1 33.6,56.39 31.97,58.03 | R40NC.1 30.48,59.51 31.97,58.03 | 31.97,58.03 v33.45,59.51
  Bottom 0.152: v33.45,59.51 34.06,60.12 34.9,60.12 R34.2
N$46  (via drill 0.35)
  Top 0.152: TP90.TP 34.98,54.63 34.98,56.31 IC1.2 34.98,56.39 34.98,56.92 36.88,58.83 v37.26,58.83
  Bottom 0.152: R35.2 38.1,59.66 v37.26,58.83
N$47  (via drill 0.35)
  Top 0.152: TP91.TP IC1.3 36.2,56.84 39.55,60.2 v39.78,60.2
  Bottom 0.152: v39.78,60.2 41.22,60.2 R36.2
N$48  (via drill 0.35)
  Top 0.152: IC1.11 40.01,64.08 v39.78,63.86
  Bottom 0.152: v39.78,63.86 40.08,63.86 40.31,64.08 42.29,64.08 57.76,48.62 57.76,48.31 SV4.4
N$49  (via drill 0.35)
  Top 0.152: v41.15,61.57 38.79,63.93 38.79,65.53 IC1.12
  Bottom 0.152: v41.15,61.57 41.91,61.57 49.23,54.25 49.23,47.85 49.76,47.32 54.33,47.32 55.24,48.23 SV4.6
N$50
  Bottom 0.152: Q4.1 73.57,25.67 R7.1
N$67
  Top 0.152: TP20.TP 35.59,71.17 35.59,72.54 35.74,72.69 U$3.22
N$68
  Top 0.152: TP19.TP 34.29,72.47 34.52,72.69 U$3.21
N$69
  Top 0.152: TP18.TP 33.07,71.17 33.07,72.54 33.22,72.69 U$3.20
N$70
  Top 0.152: TP17.TP 31.77,71.17 31.77,72.54 31.93,72.69 U$3.19
N$71
  Top 0.152: TP16.TP 30.48,72.47 30.71,72.69 U$3.18
N$72
  Top 0.152: TP15.TP 29.26,71.17 29.26,72.54 29.41,72.69 U$3.17
OS1
  Top 0.152: U3.1 20.34,27.36 18.44,27.36 TP80.TP 18.36,27.36 15.93,27.36 Q5.1
OS2
  Top 0.152: U3.2 20.34,26.06 18.44,26.06 TP85.TP 18.36,25.98 15.93,25.98 Q5.2
OSC1  (via drill 0.35)
  Top 0.152: U$2.23 63.63,64.77 64.62,65.76 64.62,66.37 v64.01,66.98
  Bottom 0.152: v64.01,66.98 62.87,68.12 61.04,68.12 60.43,68.73 C7.1 60.35,68.73 60.35,70.94 60.43,71.02 60.43,71.4 60.35,71.48 60.35,71.7 TP54.TP 60.27,71.78 60.27,72.01 59.66,72.62 59.66,73.46 60.27,74.07 60.27,74.91 Q3.2
OSC2  (via drill 0.35)
  Top 0.152: v64.01,66.06 62.48,66.06 U$2.24
  Bottom 0.152: v64.01,66.06 62.71,67.36 57.3,67.36 56.01,68.66 55.24,68.66 C8.1 55.24,68.73 54.71,69.27 54.71,71.09 55.24,71.63 TP64.TP 55.24,72.01 54.94,72.31 54.94,73.38 55.24,73.69 Q3.1
RBIAS
  Top 0.152: 51.44,54.63 53.03,54.63 U$2.14 | 51.44,54.63 50.98,55.09 48.92,55.09 R13.2 | 51.44,54.63 TP53.TP
RESET
  Top 0.152: U$2.10 53.03,59.74 51.44,59.74 TP55.TP 51.44,59.66 48.54,59.66 46.41,57.53 R12.2
RI
  Top 0.152: TP113.TP 69.19,89.53 69.19,88.77 68.35,87.94 68.35,87.48 U1.2
RTS  (via drill 0.35)
  Top 0.152: U1.24 69.72,84.58 69.8,84.51 71.09,84.51 TP105.TP 71.17,84.43 71.93,84.43 72.31,84.05 72.31,83.59 68.81,80.09 60.33,80.09 57.99,82.42 57.99,89.97 52.07,95.89 | v17.14,93.34 37.26,93.34 42.82,98.91 46.97,98.91 47.83,98.04 | 47.83,98.04 48.01,97.87 v48.01,95.96 | 49.53,98.6 48.39,98.6 47.83,98.04
  Top 0.254: 49.53,98.6 51.26,98.6 52.07,97.79 52.07,95.89
  Bottom 0.152: v17.14,93.34 16.84,93.04 16.84,92.35 Q1.2 | v48.01,95.96 48.92,95.05 48.92,90.6 47.93,89.61 47.93,88.92 R21.1
RX_232  (via drill 0.35)
  Top 0.254: v26.04,54.61 MAX232.7 U5.7 | J2.3 10.79,12.7 10.79,20.32 8.26,22.86 RS232.3
  Bottom 0.254: RS232.3 17.78,34.29 17.78,46.35 v26.04,54.61
RX_S
  Top 0.152: U5.14 MAX232.14 20.95,66.9 20.12,67.74 11.51,67.74 8.15,64.39 8.15,60.58 7.01,59.44 5.18,59.44 4.12,58.37 4.12,34.31 23.22,15.21 39.4,15.21 SCANNER.7
RX_UART1_IO14
  Top 0.152: 22.86,74.98 24.08,74.98 U$3.13 | 22.86,74.98 21.64,74.98 TP11.TP | 22.86,74.98 22.86,70.46 23.47,69.85 23.47,66.67 23.47,66.47 MAX232.12
  Top 0.254: U5.12 23.47,64.16 23.47,66.67
RX_UART2_IO25  (via drill 0.35)
  Top 0.152: TP8.TP 21.64,78.79 24.08,78.79 U$3.10 26.04,78.74 v29.84,74.93 | v29.84,69.22 27.3,66.67 MAX232.9
  Top 0.254: U5.9 MAX232.9
  Bottom 0.152: v29.84,74.93 v29.84,69.22
RXD
  Top 0.152: U1.25 69.72,85.11 71.7,85.11 TP103.TP 71.78,85.04 72.62,84.2 72.62,84.12 74.14,82.6 R39.2
RXD0  (via drill 0.35)
  Top 0.152: U$3.34 41.15,85.11 43.13,85.11 TP26.TP 43.2,85.04 45.95,82.3 v47.02,82.3 | v50.44,85.72 56.39,79.78 68.96,79.78 71.7,82.53 73.15,82.53 R39.1 73.15,82.45 73.3,82.3 v73.3,81.61
  Bottom 0.152: v47.02,82.3 v50.44,85.72 | SL1.2 89.53,89.08 86.33,85.88 86.33,79.4 85.57,78.64 76.28,78.64 v73.3,81.61
SCK_IO19
  Top 0.152: U$3.31 41.15,81.31 43.13,81.31 TP28.TP 43.2,81.23 46.94,77.5 46.94,75.36 45.72,74.14 45.72,63.7 47.17,62.26 53.03,62.26 U$2.8
SCL_IO5  (via drill 0.35)
  Top 0.152: U3.6 27.36,24.77 | 27.36,24.77 TP30.TP | v27.81,27.96 27.89,28.04 27.89,30.71 27.36,31.24 27.36,31.7 TP79.TP 27.36,31.77 28.5,31.77 31.85,35.13 31.85,52.05 34.37,54.56 34.37,60.73 38.02,64.39 38.02,67.44 | v23.77,31.77 25.3,31.77 U4.6 | v27.36,25.38 27.36,24.77 | U$3.29 41.15,78.79 43.13,78.79 TP86.TP 44.81,77.11 44.81,71.55 40.69,67.44 38.02,67.44 | IC1.14 36.2,66.06 37.57,67.44 38.02,67.44
  Bottom 0.152: 27.66,25.38 27.66,24.99 29.03,23.62 29.03,22.86 R15.2 | 27.66,25.38 27.66,27.81 v27.81,27.96 27.66,27.89 v23.77,31.77 | 27.66,25.38 v27.36,25.38
SDA_IO17  (via drill 0.35)
  Top 0.152: 25.26,28.23 24.92,27.89 24.31,27.89 24.08,27.66 24.08,24.46 24.99,23.55 25.3,23.55 U3.5 25.38,23.55 27.89,23.55 TP31.TP 29.03,22.4 v29.03,20.5 | 25.26,28.23 27.28,30.25 27.28,30.48 TP81.TP | 25.3,30.48 25.3,29.64 v25.15,29.49 | v25.15,28.27 25.22,28.27 25.26,28.23 | U$3.28 41.15,77.5 43.13,77.5 TP88.TP 43.2,77.42 44.5,76.12 44.5,71.7 40.54,67.74 36.65,67.74 34.98,66.06 34.98,65.61 IC1.15 34.9,65.53 34.9,64.24 33.76,63.09 30.48,63.09 29.23,61.85 29.23,60.02 29.95,59.31 v29.95,56.01 | 25.3,30.48 24.16,30.48 23.16,31.47 23.16,41.76 29.95,48.54 v29.95,53.87 | 25.3,30.48 U4.5
  Bottom 0.152: v29.03,20.5 29.03,19.05 R14.2 | v25.15,28.27 v25.15,29.49 | v29.95,56.01 v29.95,53.87
SENSOR_VN
  Top 0.152: TP3.TP 21.64,85.11 24.08,85.11 U$3.5
SENSOR_VP
  Top 0.152: TP2.TP 21.64,86.33 24.08,86.33 U$3.4
SI_IO21
  Top 0.152: U$2.7 50.8,63.5 50.16,62.87 46.99,62.87 46.02,63.83 46.02,72.06 49.53,75.56 49.53,78.11 43.81,83.82 TP27.TP U$3.33
SO_IO22
  Top 0.152: U$2.6 52.76,64.77 49.92,67.61 49.92,80.36 43.18,87.11 TP24.TP U$3.36
SQ  (via drill 0.35)
  Top 0.152: U3.7 25.38,26.06 27.89,26.06 TP84.TP 27.96,25.98 v28.73,25.22
  Bottom 0.152: v28.73,25.22 29.03,25.53 29.03,26.67 R18.1
TPIN+
  Top 0.152: J1.3 76.2,60.36 74.04,62.52 73.28,62.52 72.99,62.23 69.06,62.23 R4.2 65.41,61.11 65.41,59.69 63.5,57.78 60.96,57.78 59.05,55.88 U$2.13 TP57.TP
TPIN-
  Top 0.152: TP56.TP U$2.12 54.04,57.15 55.95,59.05 63.44,59.05 64.34,59.95 64.34,60.53 66.76,62.95 66.76,64.5 67.79,65.53 R3.2 69.2,64.63 71.53,64.63 72.03,64.13 J1.6
TPOUT+
  Top 0.152: U$2.17 TP63.TP 65.41,58.42 R5.2 69.06,59.69 72.39,59.69 73.03,60.33 74.3,60.33 76.2,58.42 J1.1
TPOUT-
  Top 0.152: U$2.16 TP62.TP R6.2 69.06,57.15 72.39,57.15 73.66,58.42 J1.2
TX_232  (via drill 0.35)
  Top 0.254: J2.1 6.35,12.06 RS232.4 | MAX232.8 U5.8 v27.3,61.59
  Bottom 0.254: v27.3,61.59 27.3,52.7 19.05,44.45 19.05,33.02 RS232.4
TX_S  (via drill 0.35)
  Top 0.152: MAX232.13 22.25,66.45 22.25,64.16 U5.13 22.25,64.08 22.25,63.7 23.32,62.64 v24.16,62.64
  Bottom 0.152: v24.16,62.64 26.98,62.64 28.27,63.93 29.34,63.93 32.84,60.43 32.84,36.88 38.05,31.67 38.05,11.48 SCANNER.5
TX_UART1_IO27
  Top 0.152: TP10.TP U$3.12 24.69,76.2 25.38,75.51 25.38,70.54 24.77,69.93 MAX232.11
  Top 0.254: U5.11 MAX232.11
TX_UART2_IO26
  Top 0.152: TP9.TP 21.64,77.5 24.08,77.5 U$3.11 24.16,77.42 24.69,77.42 25.98,76.12 25.98,66.52 MAX232.10 26.06,66.45 26.06,66.14 26.04,66.04
  Top 0.254: U5.10 26.04,66.04
TXD
  Top 0.152: U1.26 69.72,85.65 69.8,85.72 TP104.TP 73.53,85.72 74.14,85.11 R38.2
TXD0
  Top 0.152: TP25.TP 43.13,86.41 41.15,86.41 U$3.35 41.07,86.41 39.27,86.41 37.95,87.73 37.95,88.77 40.84,91.67 44.35,91.67 46.02,89.99 46.02,89.23 55.78,79.48 72.08,79.48 74.75,82.14 74.75,82.98 74.71,83.02 | 74.71,83.02 73.23,84.51 73.23,85.04 R38.1 | 74.71,83.02 78.64,86.94 89.53,86.94 SL1.3
USB_DN
  Top 0.152: TP111.TP 77.5,90.83 77.5,92.2 J4.2 77.5,92.28 77.5,92.81 78.41,93.73 78.94,93.73 79.17,93.95 79.17,96.01 77.62,97.56 67.77,97.56 65.95,95.75 | U1.5 66.75,87.48 66.67,87.55 TP99.TP 66.67,88.92 64.92,88.92 62.48,91.36 62.48,95.78 63.32,96.62 65.08,96.62 65.95,95.75 | 65.95,95.75 65.99,95.71 65.99,95.02 J3.2
USB_DP  (via drill 0.35)
  Top 0.152: U1.4 67.36,87.48 67.36,89.53 TP100.TP 67.28,89.53 v66.67,90.14 | TP110.TP 76.2,90.98 76.81,91.59 76.81,92.2 J4.3 76.81,92.28 76.81,92.81 76.43,93.19 75.21,93.19 74.56,93.84 | J3.3 66.67,95.71 67.59,96.62 73.91,96.62 74.52,96.01 74.52,93.88 74.56,93.84 | v68.05,90.68 71.4,90.68 74.56,93.84
  Bottom 0.152: v66.67,90.14 67.51,90.14 v68.05,90.68
VBUS  (via drill 0.35)
  Top 0.254: v70.03,89.76 70.26,89.53 77.04,89.53 78.11,90.6 78.11,92.2 J4.1 | v65.23,89.53 65.23,93.42 65.3,93.5 65.3,94.94 J3.1
  Bottom 0.254: v70.03,89.76 69.72,89.46 65.23,89.46 | 65.23,89.46 64.47,89.46 63.17,90.75 62.41,90.75 D1.A 62.26,90.83 61.65,90.83 60.35,89.53 60.35,89.15 59.51,88.32 58.98,88.32 R1.2 | v65.23,89.53 65.23,89.46
VCAP
  Top 0.152: TP50.TP 51.44,71.17 53.03,71.17 U$2.1 53.11,71.09 53.49,71.09 54.33,70.26 54.33,64.39 54.18,64.24 51.97,64.24 48.92,67.28 48.92,68.43 C6.+

## Text on the board
tPlace: C:/Users/ahmed/Downloads/imageonline-monochrome-7665118.bmp
tNames: +5V | GND | LCD | 5V | SIG | GND | TX | RX | NC | GND | GND | NC | TX | RX | -VE | +VE | PB | PB | PRINTER | Parking Parking! / GDS-PP300L
bNames: NC | COM | NO